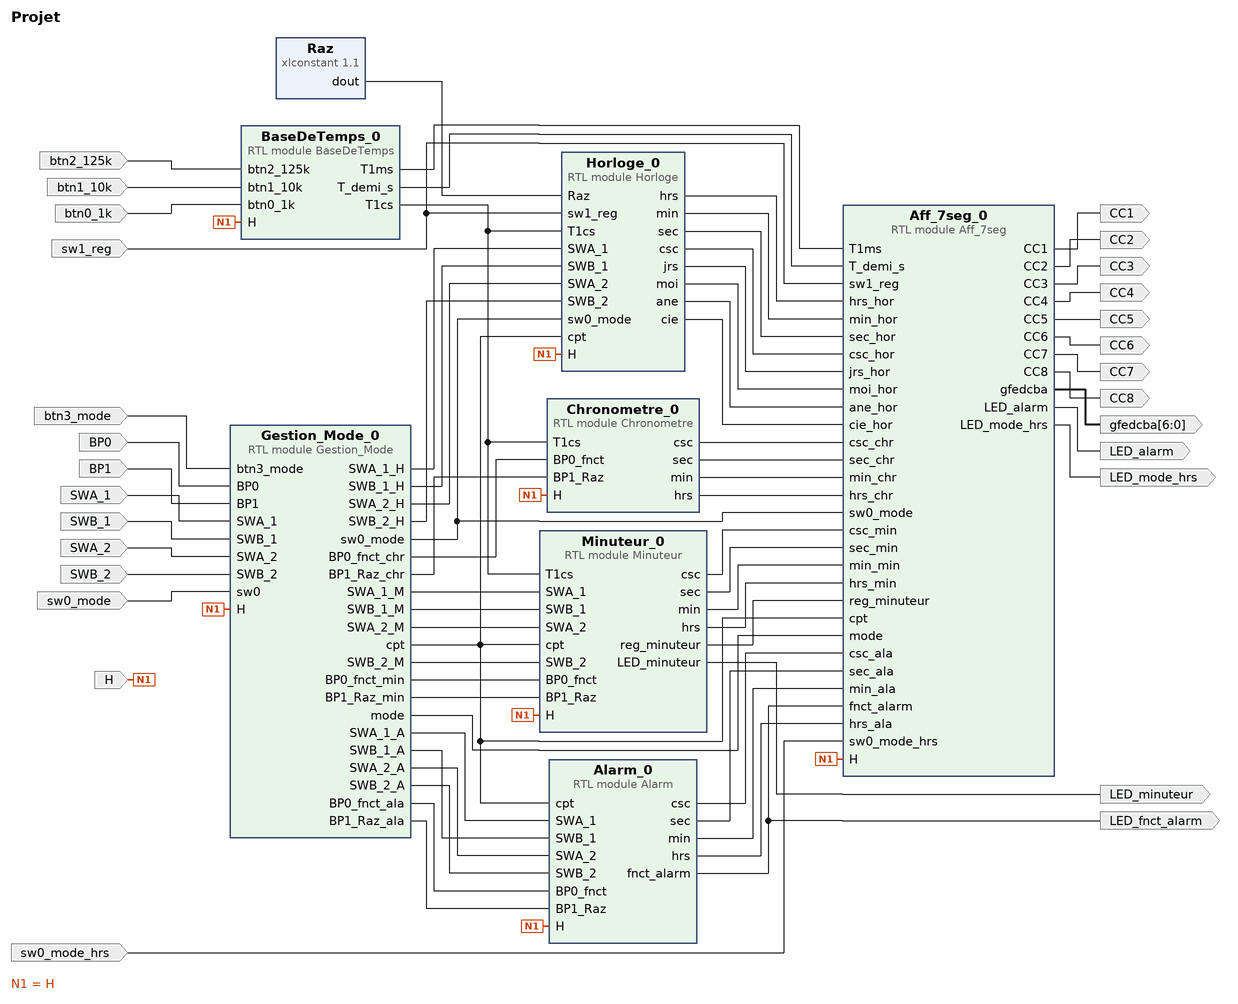
[diagram p0: block diagram of the top level]
# Vivado block design Projet, xc7z020clg400-1, Vivado 2020.2
create_bd_design Projet

create_bd_port -dir I H
create_bd_port -dir I btn0_1k
create_bd_port -dir I btn1_10k
create_bd_port -dir I btn2_125k
create_bd_port -dir O -from 6 -to 0 gfedcba
create_bd_port -dir O LED_mode_hrs
create_bd_port -dir O CC1
create_bd_port -dir O CC2
create_bd_port -dir O CC3
create_bd_port -dir O CC4
create_bd_port -dir O CC5
create_bd_port -dir O CC6
create_bd_port -dir O CC7
create_bd_port -dir O CC8
create_bd_port -dir I btn3_mode
create_bd_port -dir I BP0
create_bd_port -dir I BP1
create_bd_port -dir I SWA_1
create_bd_port -dir I SWB_1
create_bd_port -dir I SWA_2
create_bd_port -dir I SWB_2
create_bd_port -dir O LED_minuteur
create_bd_port -dir O LED_alarm
create_bd_port -dir I sw0_mode
create_bd_port -dir I sw1_reg
create_bd_port -dir I sw0_mode_hrs
create_bd_port -dir O LED_fnct_alarm

create_bd_cell -type ip -vlnv xilinx.com:ip:xlconstant:1.1 Raz
set_property -dict {CONFIG.CONST_VAL 0} [get_bd_cells Raz]
create_bd_cell -type module -reference Chronometre Chronometre_0
create_bd_cell -type module -reference BaseDeTemps BaseDeTemps_0
create_bd_cell -type module -reference Aff_7seg Aff_7seg_0
create_bd_cell -type module -reference Gestion_Mode Gestion_Mode_0
create_bd_cell -type module -reference Minuteur Minuteur_0
create_bd_cell -type module -reference Alarm Alarm_0
create_bd_cell -type module -reference Horloge Horloge_0

# ---- connections ----

connect_bd_net [get_bd_ports H] \
  [get_bd_pins Chronometre_0/H] [get_bd_pins BaseDeTemps_0/H] [get_bd_pins Aff_7seg_0/H] [get_bd_pins Gestion_Mode_0/H] \
  [get_bd_pins Minuteur_0/H] [get_bd_pins Alarm_0/H] [get_bd_pins Horloge_0/H]
connect_bd_net [get_bd_pins BaseDeTemps_0/T1cs] [get_bd_pins Chronometre_0/T1cs] [get_bd_pins Minuteur_0/T1cs] [get_bd_pins Horloge_0/T1cs]
connect_bd_net [get_bd_pins BaseDeTemps_0/T1ms] [get_bd_pins Aff_7seg_0/T1ms]
connect_bd_net [get_bd_ports sw1_reg] [get_bd_pins Aff_7seg_0/sw1_reg] [get_bd_pins Horloge_0/sw1_reg]
connect_bd_net [get_bd_pins Horloge_0/hrs] [get_bd_pins Aff_7seg_0/hrs_hor]
connect_bd_net [get_bd_pins Horloge_0/min] [get_bd_pins Aff_7seg_0/min_hor]
connect_bd_net [get_bd_pins Horloge_0/sec] [get_bd_pins Aff_7seg_0/sec_hor]
connect_bd_net [get_bd_pins Horloge_0/csc] [get_bd_pins Aff_7seg_0/csc_hor]
connect_bd_net [get_bd_pins Horloge_0/jrs] [get_bd_pins Aff_7seg_0/jrs_hor]
connect_bd_net [get_bd_pins Horloge_0/moi] [get_bd_pins Aff_7seg_0/moi_hor]
connect_bd_net [get_bd_pins Horloge_0/ane] [get_bd_pins Aff_7seg_0/ane_hor]
connect_bd_net [get_bd_pins Horloge_0/cie] [get_bd_pins Aff_7seg_0/cie_hor]
connect_bd_net [get_bd_ports btn2_125k] [get_bd_pins BaseDeTemps_0/btn2_125k]
connect_bd_net [get_bd_ports btn1_10k] [get_bd_pins BaseDeTemps_0/btn1_10k]
connect_bd_net [get_bd_ports btn0_1k] [get_bd_pins BaseDeTemps_0/btn0_1k]
connect_bd_net [get_bd_pins Aff_7seg_0/gfedcba] [get_bd_ports gfedcba]
connect_bd_net [get_bd_pins Aff_7seg_0/LED_mode_hrs] [get_bd_ports LED_mode_hrs]
connect_bd_net [get_bd_pins Aff_7seg_0/CC1] [get_bd_ports CC1]
connect_bd_net [get_bd_pins Aff_7seg_0/CC2] [get_bd_ports CC2]
connect_bd_net [get_bd_pins Aff_7seg_0/CC3] [get_bd_ports CC3]
connect_bd_net [get_bd_pins Aff_7seg_0/CC4] [get_bd_ports CC4]
connect_bd_net [get_bd_pins Aff_7seg_0/CC5] [get_bd_ports CC5]
connect_bd_net [get_bd_pins Aff_7seg_0/CC6] [get_bd_ports CC6]
connect_bd_net [get_bd_pins Aff_7seg_0/CC7] [get_bd_ports CC7]
connect_bd_net [get_bd_pins Aff_7seg_0/CC8] [get_bd_ports CC8]
connect_bd_net [get_bd_ports btn3_mode] [get_bd_pins Gestion_Mode_0/btn3_mode]
connect_bd_net -net BP0_1 [get_bd_ports BP0] [get_bd_pins Gestion_Mode_0/BP0]
connect_bd_net -net BP1_1 [get_bd_ports BP1] [get_bd_pins Gestion_Mode_0/BP1]
connect_bd_net -net Gestion_Mode_0_BP0_fnct [get_bd_pins Gestion_Mode_0/BP0_fnct_chr] [get_bd_pins Chronometre_0/BP0_fnct]
connect_bd_net -net Gestion_Mode_0_BP1_Raz [get_bd_pins Gestion_Mode_0/BP1_Raz_chr] [get_bd_pins Chronometre_0/BP1_Raz]
connect_bd_net [get_bd_pins Chronometre_0/csc] [get_bd_pins Aff_7seg_0/csc_chr]
connect_bd_net [get_bd_pins Chronometre_0/sec] [get_bd_pins Aff_7seg_0/sec_chr]
connect_bd_net [get_bd_pins Chronometre_0/min] [get_bd_pins Aff_7seg_0/min_chr]
connect_bd_net [get_bd_pins Chronometre_0/hrs] [get_bd_pins Aff_7seg_0/hrs_chr]
connect_bd_net [get_bd_pins Gestion_Mode_0/mode] [get_bd_pins Aff_7seg_0/mode]
connect_bd_net [get_bd_pins Raz/dout] [get_bd_pins Horloge_0/Raz]
connect_bd_net -net SWA_1_1 [get_bd_ports SWA_1] [get_bd_pins Gestion_Mode_0/SWA_1]
connect_bd_net -net SWB_1_1 [get_bd_ports SWB_1] [get_bd_pins Gestion_Mode_0/SWB_1]
connect_bd_net -net SWA_2_1 [get_bd_ports SWA_2] [get_bd_pins Gestion_Mode_0/SWA_2]
connect_bd_net -net SWB_2_1 [get_bd_ports SWB_2] [get_bd_pins Gestion_Mode_0/SWB_2]
connect_bd_net [get_bd_pins Gestion_Mode_0/SWA_1_M] [get_bd_pins Minuteur_0/SWA_1]
connect_bd_net [get_bd_pins Gestion_Mode_0/SWB_1_M] [get_bd_pins Minuteur_0/SWB_1]
connect_bd_net [get_bd_pins Gestion_Mode_0/SWA_2_M] [get_bd_pins Minuteur_0/SWA_2]
connect_bd_net [get_bd_pins Gestion_Mode_0/SWB_2_M] [get_bd_pins Minuteur_0/SWB_2]
connect_bd_net [get_bd_pins Gestion_Mode_0/BP0_fnct_min] [get_bd_pins Minuteur_0/BP0_fnct]
connect_bd_net [get_bd_pins Gestion_Mode_0/BP1_Raz_min] [get_bd_pins Minuteur_0/BP1_Raz]
connect_bd_net [get_bd_pins Minuteur_0/LED_minuteur] [get_bd_ports LED_minuteur]
connect_bd_net [get_bd_pins Minuteur_0/csc] [get_bd_pins Aff_7seg_0/csc_min]
connect_bd_net [get_bd_pins Minuteur_0/sec] [get_bd_pins Aff_7seg_0/sec_min]
connect_bd_net [get_bd_pins Minuteur_0/min] [get_bd_pins Aff_7seg_0/min_min]
connect_bd_net [get_bd_pins Minuteur_0/hrs] [get_bd_pins Aff_7seg_0/hrs_min]
connect_bd_net [get_bd_pins Gestion_Mode_0/SWA_1_A] [get_bd_pins Alarm_0/SWA_1]
connect_bd_net [get_bd_pins Gestion_Mode_0/SWB_1_A] [get_bd_pins Alarm_0/SWB_1]
connect_bd_net [get_bd_pins Gestion_Mode_0/SWA_2_A] [get_bd_pins Alarm_0/SWA_2]
connect_bd_net [get_bd_pins Gestion_Mode_0/SWB_2_A] [get_bd_pins Alarm_0/SWB_2]
connect_bd_net [get_bd_pins Gestion_Mode_0/BP0_fnct_ala] [get_bd_pins Alarm_0/BP0_fnct]
connect_bd_net [get_bd_pins Gestion_Mode_0/BP1_Raz_ala] [get_bd_pins Alarm_0/BP1_Raz]
connect_bd_net [get_bd_pins Alarm_0/csc] [get_bd_pins Aff_7seg_0/csc_ala]
connect_bd_net [get_bd_pins Alarm_0/sec] [get_bd_pins Aff_7seg_0/sec_ala]
connect_bd_net [get_bd_pins Alarm_0/min] [get_bd_pins Aff_7seg_0/min_ala]
connect_bd_net [get_bd_pins Alarm_0/hrs] [get_bd_pins Aff_7seg_0/hrs_ala]
connect_bd_net [get_bd_pins Alarm_0/fnct_alarm] [get_bd_ports LED_fnct_alarm] [get_bd_pins Aff_7seg_0/fnct_alarm]
connect_bd_net [get_bd_pins Aff_7seg_0/LED_alarm] [get_bd_ports LED_alarm]
connect_bd_net [get_bd_ports sw0_mode_hrs] [get_bd_pins Aff_7seg_0/sw0_mode_hrs]
connect_bd_net [get_bd_pins Gestion_Mode_0/SWA_1_H] [get_bd_pins Horloge_0/SWA_1]
connect_bd_net [get_bd_pins Gestion_Mode_0/SWB_1_H] [get_bd_pins Horloge_0/SWB_1]
connect_bd_net [get_bd_pins Gestion_Mode_0/SWA_2_H] [get_bd_pins Horloge_0/SWA_2]
connect_bd_net [get_bd_pins Gestion_Mode_0/SWB_2_H] [get_bd_pins Horloge_0/SWB_2]
connect_bd_net [get_bd_pins BaseDeTemps_0/T_demi_s] [get_bd_pins Aff_7seg_0/T_demi_s]
connect_bd_net [get_bd_ports sw0_mode] [get_bd_pins Gestion_Mode_0/sw0]
connect_bd_net [get_bd_pins Gestion_Mode_0/sw0_mode] [get_bd_pins Aff_7seg_0/sw0_mode] [get_bd_pins Horloge_0/sw0_mode]
connect_bd_net [get_bd_pins Gestion_Mode_0/cpt] \
  [get_bd_pins Aff_7seg_0/cpt] [get_bd_pins Minuteur_0/cpt] [get_bd_pins Alarm_0/cpt] [get_bd_pins Horloge_0/cpt]
connect_bd_net [get_bd_pins Minuteur_0/reg_minuteur] [get_bd_pins Aff_7seg_0/reg_minuteur]

validate_bd_design
save_bd_design
